# EAGLE design XY-Z (EAGLE 9.4.0)
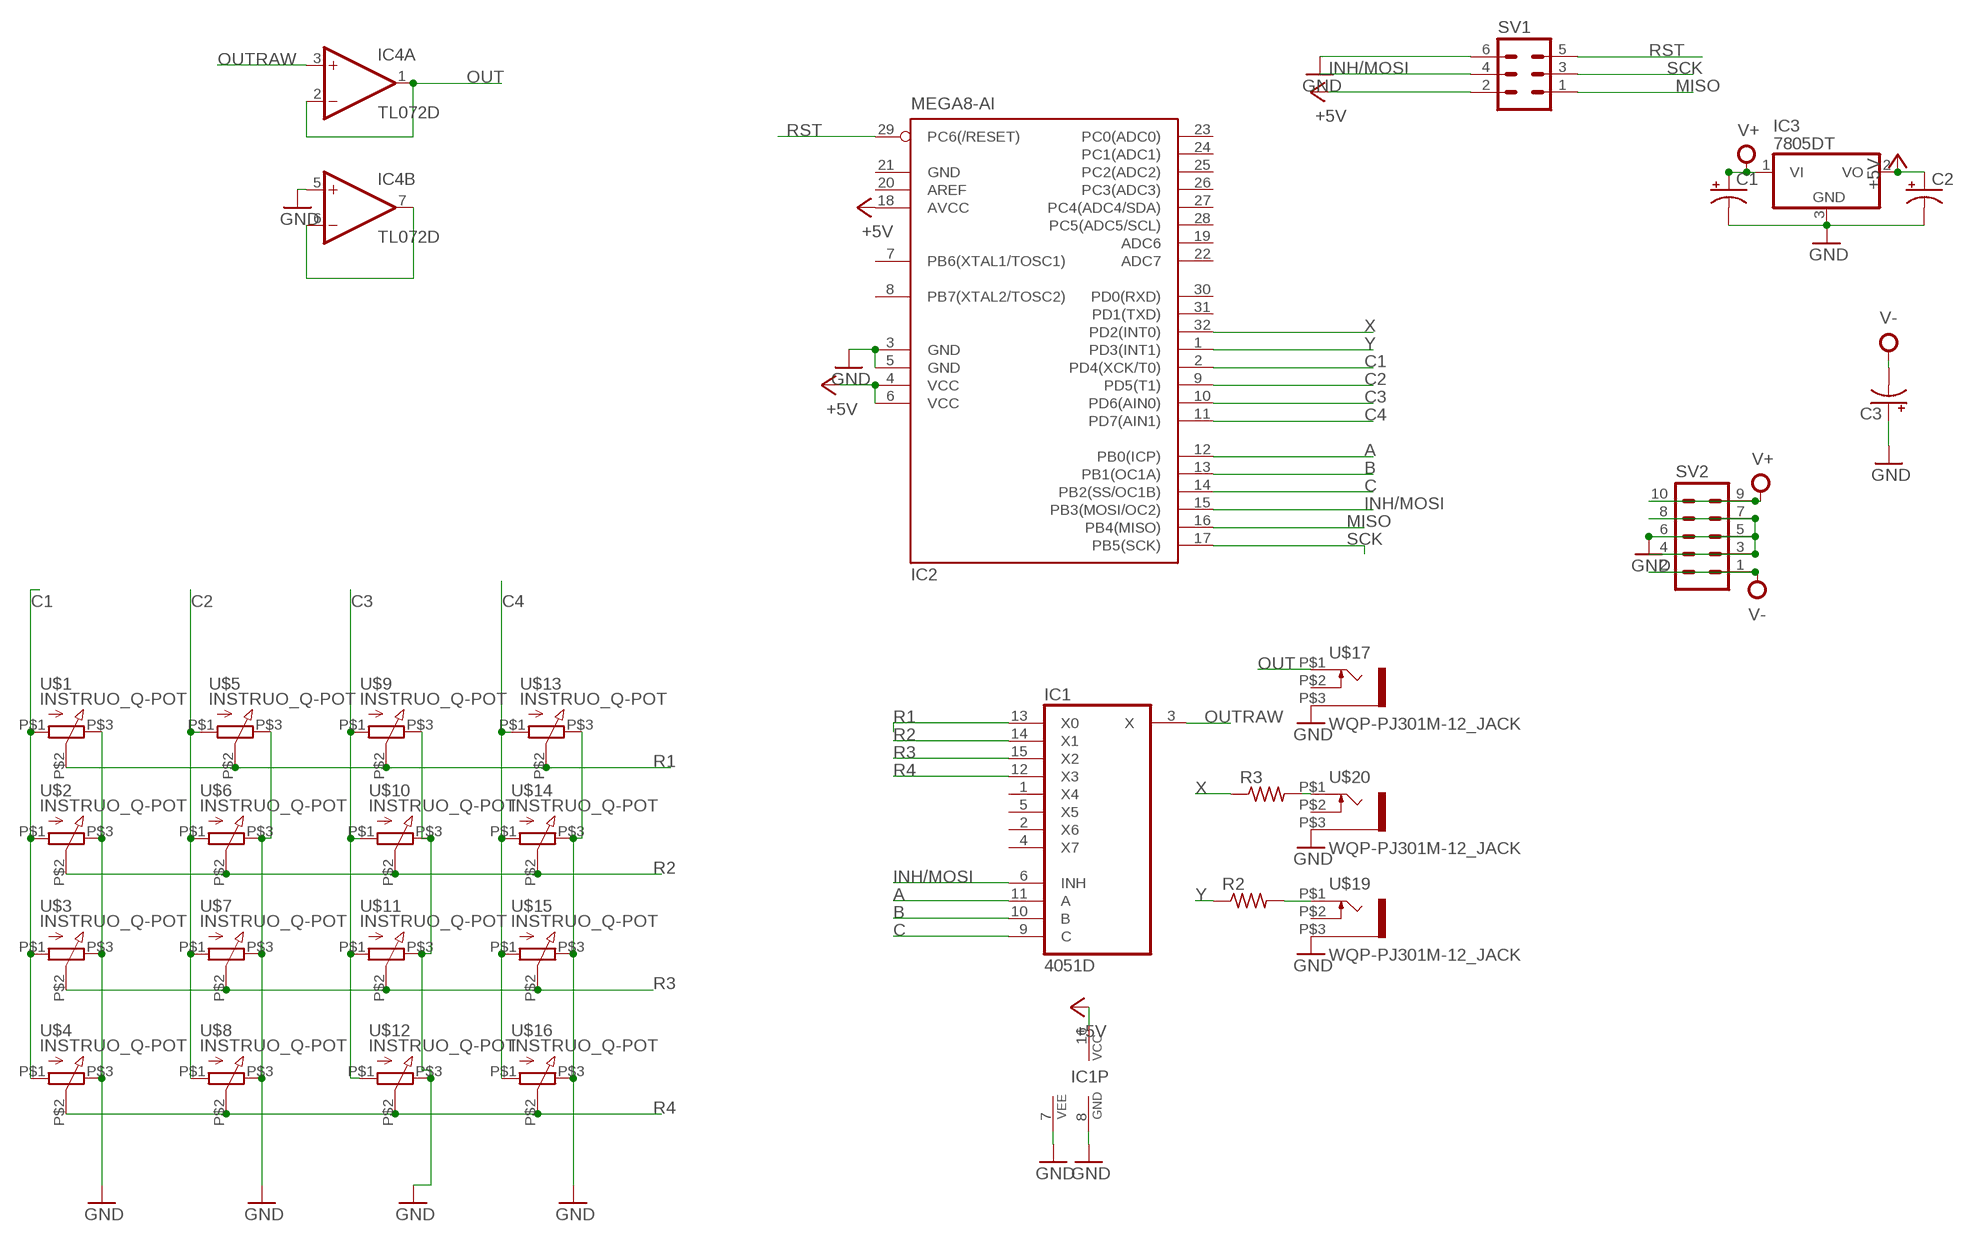
[diagram p0: schematic, sheet 1]

## Parts
C1  CPOL-US153CLV-0505  [153CLV-0505]
C2  CPOL-US153CLV-0505  [153CLV-0505]
C3  CPOL-US153CLV-0505  [153CLV-0505]
IC1  4051D  [SO16]
IC2  MEGA8-AI  [TQFP32-08]
IC3  7805DT  [TO252]
IC4  TL072D  [SO08]
R2  R-US_M0805  [M0805]
R3  R-US_M0805  [M0805]
SV1  MA03-2  [MA03-2]
SV2  MA05-2  [MA05-2]
U$1  INSTRUO_Q-POT  [INSTRUO_Q-POT]
U$2  INSTRUO_Q-POT  [INSTRUO_Q-POT]
U$3  INSTRUO_Q-POT  [INSTRUO_Q-POT]
U$4  INSTRUO_Q-POT  [INSTRUO_Q-POT]
U$5  INSTRUO_Q-POT  [INSTRUO_Q-POT]
U$6  INSTRUO_Q-POT  [INSTRUO_Q-POT]
U$7  INSTRUO_Q-POT  [INSTRUO_Q-POT]
U$8  INSTRUO_Q-POT  [INSTRUO_Q-POT]
U$9  INSTRUO_Q-POT  [INSTRUO_Q-POT]
U$10  INSTRUO_Q-POT  [INSTRUO_Q-POT]
U$11  INSTRUO_Q-POT  [INSTRUO_Q-POT]
U$12  INSTRUO_Q-POT  [INSTRUO_Q-POT]
U$13  INSTRUO_Q-POT  [INSTRUO_Q-POT]
U$14  INSTRUO_Q-POT  [INSTRUO_Q-POT]
U$15  INSTRUO_Q-POT  [INSTRUO_Q-POT]
U$16  INSTRUO_Q-POT  [INSTRUO_Q-POT]
U$17  WQP-PJ301M-12_JACK  [WQP-PJ301M-12_JACK]
U$19  WQP-PJ301M-12_JACK  [WQP-PJ301M-12_JACK]
U$20  WQP-PJ301M-12_JACK  [WQP-PJ301M-12_JACK]

## Nets
+5V: C2.+ IC1.16(VCC) IC2.4(VCC) IC2.6(VCC) IC2.18(AVCC) IC3.2(VO) SV1.2
A: IC1.11(A) IC2.12(PB0(ICP))
B: IC1.10(B) IC2.13(PB1(OC1A))
C: IC1.9(C) IC2.14(PB2(SS/OC1B))
C1: IC2.2(PD4(XCK/T0)) U$1.P$1 U$2.P$1 U$3.P$1 U$4.P$1
C2: IC2.9(PD5(T1)) U$5.P$1 U$6.P$1 U$7.P$1 U$8.P$1
C3: IC2.10(PD6(AIN0)) U$9.P$1 U$10.P$1 U$11.P$1 U$12.P$1
C4: IC2.11(PD7(AIN1)) U$13.P$1 U$14.P$1 U$15.P$1 U$16.P$1
GND: C1.- C2.- C3.+ IC1.7(VEE) IC1.8(GND) IC2.3(GND) IC2.5(GND) IC3.3(GND) IC4.5(B:+IN) SV1.6 SV2.3 SV2.4 SV2.5 SV2.6 SV2.7 SV2.8 U$1.P$3 U$2.P$3 U$3.P$3 U$4.P$3 U$5.P$3 U$6.P$3 U$7.P$3 U$8.P$3 U$9.P$3 U$10.P$3 U$11.P$3 U$12.P$3 U$13.P$3 U$14.P$3 U$15.P$3 U$16.P$3 U$17.P$3 U$19.P$3 U$20.P$3
INH/MOSI: IC1.6(INH) IC2.15(PB3(MOSI/OC2)) SV1.4
MISO: IC2.16(PB4(MISO)) SV1.1
N$1: R2.2 U$19.P$1
N$2: R3.2 U$20.P$1
N$3: IC4.6(B:-IN) IC4.7(B:OUT)
OUT: IC4.1(A:OUT) IC4.2(A:-IN) U$17.P$1
OUTRAW: IC1.3(X) IC4.3(A:+IN)
R1: IC1.13(X0) U$1.P$2 U$5.P$2 U$9.P$2 U$13.P$2
R2: IC1.14(X1) U$2.P$2 U$6.P$2 U$10.P$2 U$14.P$2
R3: IC1.15(X2) U$3.P$2 U$7.P$2 U$11.P$2 U$15.P$2
R4: IC1.12(X3) U$4.P$2 U$8.P$2 U$12.P$2 U$16.P$2
RST: IC2.29(PC6(/RESET)) SV1.5
SCK: IC2.17(PB5(SCK)) SV1.3
V+: C1.+ IC3.1(VI) SV2.9 SV2.10
V-: C3.- SV2.1 SV2.2
X: IC2.32(PD2(INT0)) R3.1
Y: IC2.1(PD3(INT1)) R2.1
Unconnected: IC1.1(X4) IC1.2(X6) IC1.4(X7) IC1.5(X5) IC2.7(PB6(XTAL1/TOSC1)) IC2.8(PB7(XTAL2/TOSC2)) IC2.19(ADC6) IC2.20(AREF) IC2.22(ADC7) IC2.23(PC0(ADC0)) IC2.24(PC1(ADC1)) IC2.25(PC2(ADC2)) IC2.26(PC3(ADC3)) IC2.27(PC4(ADC4/SDA)) IC2.28(PC5(ADC5/SCL)) IC2.30(PD0(RXD)) IC2.31(PD1(TXD)) U$17.P$2 U$19.P$2 U$20.P$2

## Power pins joined to a net without a drawn wire
GND: IC2.21(GND)
V+: IC4.8(P:V+)
V-: IC4.4(P:V-)

## Library data of the parts
C1-C3 = rcl:CPOL-US: POLARIZED CAPACITOR, American symbol; SPICEPREFIX: C
IC1 = 40xx:4051: 8-channel ANALOG MULTIPLEXER
IC2 = atmel:MEGA8: MICROCONTROLLER 8 Kbytes FLASH, 1 kbytes SRAM, 512 bytes EEPROM, USART, 6-channel 10 bit ADC, 2-channel 8 bit ADC Pin compatible with Atmega48, ATMega88, ATMega168 Source: avr.lbr; MPN: ATMEGA8-16AU; OC_FARNELL: 9171371; OC_NEWARK: 73M8863
IC3 = linear:78*: Positive VOLTAGE REGULATOR Source: http://cache.national.com/ds/LM/LM78L05.pdf http://www.fairchildsemi.com/ds/LM/LM7805.pdf
IC4 = linear3:TL072: OP AMP
R2 R3 = adafruit:R-US_: RESISTOR, American symbol
SV1 = con-lstb:MA03-2: PIN HEADER; OC_FARNELL: unknown; OC_NEWARK: unknown
SV2 = con-lstb:MA05-2: PIN HEADER; OC_FARNELL: unknown; OC_NEWARK: unknown
U$1-U$16 = Pure_VCO_SMD_V2_2:INSTRUO_Q-POT
U$17 U$19 U$20 = thonkiconn:WQP-PJ301M-12_JACK

## Board
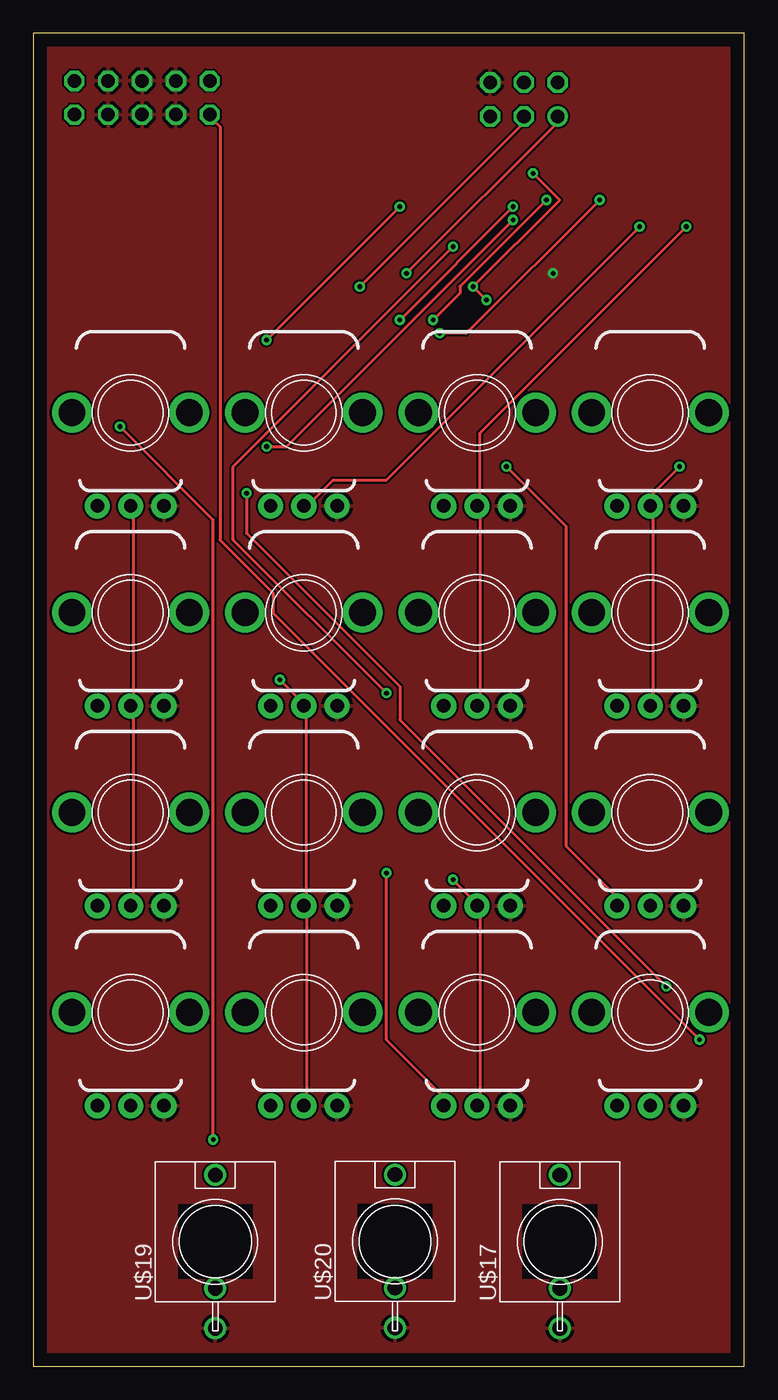
[diagram p1: board, top side]
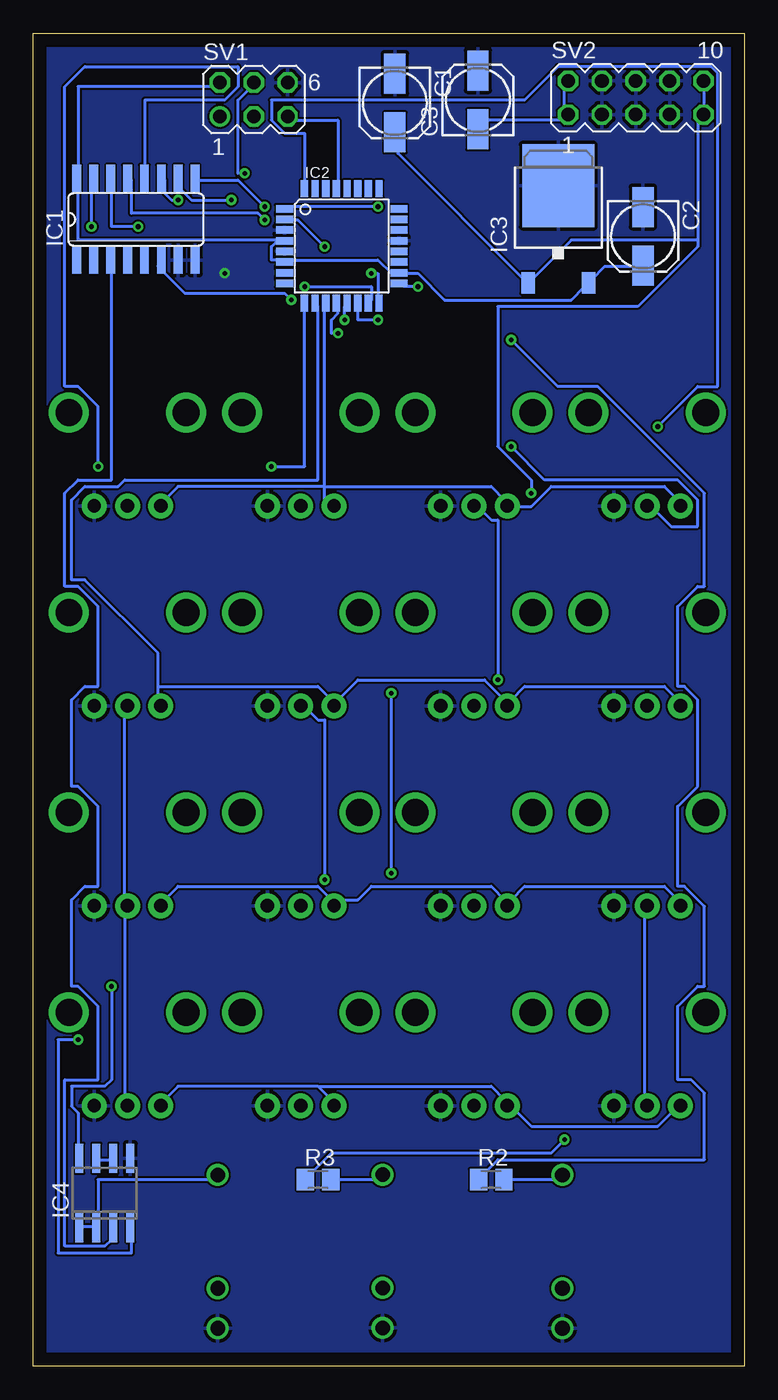
[diagram p2: board, bottom side, seen from below]

Size 53.37 x 100 mm. Coordinates in mm from the lower left corner, seen from the top.
Outline: 0,0 53.37,0 53.37,100 0,100 0,0
Copper layers (1*16): Top 0.035mm / dielectric 1.5mm / Bottom 0.035mm
Design rules "default *": minimum track width 9mil, minimum drill 0.35mm, track to track 6mil, track to pad 6mil, pad to pad 6mil, via to via 6mil, smd to smd 6mil, copper to edge 40mil, drill to drill 6mil, minimum pad ring 10mil, minimum via ring 8mil, stop-mask expansion 4mil, vias tented up to drill 0mil, thermal gap 10mil

### Footprints (pad centres in the part's own frame; a part is rotated, then mirrored left to right if it is on the bottom)
153CLV-0505 = smd 3 x 1.6: + 2.2,0; - -2.2,0
SO16 = smd 0.66 x 2.032: 1 -4.445,-3.073; 2 -3.175,-3.073; 3 -1.905,-3.073; 4 -0.635,-3.073; 5 0.635,-3.073; 6 1.905,-3.073; 7 3.175,-3.073; 8 4.445,-3.073; 9 4.445,3.073; 10 3.175,3.073; 11 1.905,3.073; 12 0.635,3.073; 13 -0.635,3.073; 14 -1.905,3.073; 15 -3.175,3.073; 16 -4.445,3.073
TQFP32-08 = smd 1.27 x 0.559: 1 -4.293,2.8; 2 -4.293,2; 3 -4.293,1.2; 4 -4.293,0.4; 5 -4.293,-0.4; 6 -4.293,-1.2; 7 -4.293,-2; 8 -4.293,-2.8; 17 4.293,-2.8; 18 4.293,-2; 19 4.293,-1.2; 20 4.293,-0.4; 21 4.293,0.4; 22 4.293,1.2; 23 4.293,2; 24 4.293,2.8 | smd 0.559 x 1.27: 9 -2.8,-4.293; 10 -2,-4.293; 11 -1.2,-4.293; 12 -0.4,-4.293; 13 0.4,-4.293; 14 1.2,-4.293; 15 2,-4.293; 16 2.8,-4.293; 25 2.8,4.293; 26 2,4.293; 27 1.2,4.293; 28 0.4,4.293; 29 -0.4,4.293; 30 -1.2,4.293; 31 -2,4.293; 32 -2.8,4.293
TO252 = smd 1 x 1.6: 1 -2.28,-4.8; 2 2.28,-4.8 | smd 5.4 x 6.2: 3 0,2.5
SO08 = smd 0.6 x 2.2: 1 -1.905,-2.6; 2 -0.635,-2.6; 3 0.635,-2.6; 4 1.905,-2.6; 5 1.905,2.6; 6 0.635,2.6; 7 -0.635,2.6; 8 -1.905,2.6
M0805 = smd 1.3 x 1.6: 1 -0.95,0; 2 0.95,0
MA03-2 = drill 1.016: 1 -2.54,-1.27 | drill 1.016 octagon: 2 -2.54,1.27; 3 0,-1.27; 4 0,1.27; 5 2.54,-1.27; 6 2.54,1.27
MA05-2 = drill 1.016 octagon: 1 -5.08,-1.27; 2 -5.08,1.27; 3 -2.54,-1.27; 4 -2.54,1.27; 5 0,-1.27; 6 0,1.27; 7 2.54,-1.27; 8 2.54,1.27; 9 5.08,-1.27; 10 5.08,1.27
INSTRUO_Q-POT = drill 1 pad 1.88: P$1 -2.5,-7; P$2 0,-7; P$3 2.5,-7 | drill 2 pad 2.68: P$4 -4.4,0; P$5 4.4,0
WQP-PJ301M-12_JACK = drill 1.1: P$1 0,5; P$2 0,-3.5; P$3 0,-6.5

### Placement (x,y rotation side)
C1  26.23,94.77 270 bottom
C2  7.61,84.77 270 bottom
C3  20,95 90 bottom
IC1  45.66,86.04 0 bottom
IC2  30.22,84.04 0 bottom
IC3  13.96,86.07 0 bottom
IC4  48,13 0 bottom
R2  19,14 0 bottom
R3  32,14 0 bottom
SV1  36.82,95.04 0 bottom
SV2  8.15,95.17 0 bottom
U$1  7.3,26.54 0 top
U$2  20.3,26.54 0 top
U$3  33.3,26.54 0 top
U$4  46.3,26.54 0 top
U$5  7.3,41.54 0 top
U$6  20.3,41.54 0 top
U$7  33.3,41.54 0 top
U$8  46.3,41.54 0 top
U$9  7.3,56.54 0 top
U$10  20.3,56.54 0 top
U$11  33.3,56.54 0 top
U$12  46.3,56.54 0 top
U$13  7.3,71.54 0 top
U$14  20.3,71.54 0 top
U$15  33.3,71.54 0 top
U$16  46.3,71.54 0 top
U$17  39.52,9.34 0 top
U$19  13.66,9.34 0 top
U$20  27.14,9.37 0 top

### Tracks (layer width: path | path; a pad name or v marks a point on that pad's centre or on a via)
+5V
  Bottom 0.229: SV1.2 39.5,96 50,96 50,89.5 IC1.16 50,89 50,84.5 35,84.5 | C2.+ 8,82.5 10.5,82.5 11.5,81.5 IC3.2 12,81 13,80 22.5,80 24.5,82 25.5,82 IC2.18 26,82 26.5,82 27.5,83 34.5,83 IC2.6 35,83 35.5,83 35.5,84 35,84.5 | 35,84.5 IC2.4
A  (via drill 0.35)
  Top 0.229: v30.5,77.5 32.5,77.5 v42.5,87.5
  Bottom 0.229: v30.5,77.5 31,77.5 31,78.5 30.5,79 30.5,79.5 IC2.12 | v42.5,87.5 43,87.5 43.5,88 43.5,89 IC1.11
B  (via drill 0.35)
  Top 0.229: v30,78.5 32,80.5 32,81 v38.5,87.5
  Bottom 0.229: v30,78.5 30,79.5 IC2.13 | v38.5,87.5 41.5,87.5 42.5,88.5 42.5,89 IC1.10
C  (via drill 0.35)
  Top 0.229: v36,87 v27.5,78.5
  Bottom 0.229: v27.5,78.5 29,78.5 29,79.5 IC2.14 | v36,87 38,89 41,89 IC1.9
C1  (via drill 0.35)
  Top 0.229: v31.5,84 15,67.5 15,62 v26.5,50.5 | v26.5,37 26.5,24.5 31,20 U$3.P$1
  Bottom 0.229: U$1.P$1 5,19.5 6.5,18 16,18 17.5,19.5 U$2.P$1 18,20 19,21 32,21 | v31.5,84 33.5,86 34.5,86 IC2.2 | v26.5,37 v26.5,50.5 | 32,21 42.5,21 43.5,20 U$4.P$1 | 32,21 31,20 U$3.P$1
C2  (via drill 0.35)
  Top 0.229: v35.5,67.5 40,63 40,39 44,35 U$8.P$1
  Bottom 0.229: U$5.P$1 5,35 6,36 16.5,36 17.5,35 U$6.P$1 18,35 19,36 28,36 29,35 30.5,35 U$7.P$1 31,35 32,36 42.5,36 43.5,35 U$8.P$1 | v35.5,67.5 33,67.5 33,79.5 IC2.9
C3
  Bottom 0.229: U$9.P$1 5,50 6,51 16.5,51 17.5,50 U$10.P$1 18,50 19.5,51.5 29,51.5 30.5,50 U$11.P$1 31,50 32,51 44,51 | 44,51 44,50 U$12.P$1 | 44,51 44,53.5 49.5,59 50.5,59 50.5,65 49.5,66 47,66 46.5,66.5 32,66.5 32,79.5 IC2.10
C4
  Bottom 0.229: U$13.P$1 5,65 6,66 14.5,66 16,64.5 17.5,64.5 U$14.P$1 18,65 19,66 31.5,66 | 31.5,66 31.5,65 31,65 U$15.P$1 | 31.5,66 31.5,79.5 IC2.11 | 31.5,66 42.5,66 43.5,65 U$16.P$1
GND  (via drill 0.35)
  other vias: 39,82
  pour Top: 0,100 53.29,100 53.34,99.95 53.34,0 0,0
  pour Bottom: 0,100 0,0 53.34,0 53.34,99.95 0.05,99.95
INH/MOSI  (via drill 0.35)
  Top 0.229: v34,80 v33,81 39.5,87.5 v37.5,89.5
  Bottom 0.229: v33,81 28,81 28,80 IC2.15 | v34,80 34.5,80.5 42,80.5 44,82.5 IC1.6 | v37.5,89.5 38,89.5 38,95 37,96 SV1.4
MISO  (via drill 0.35)
  Top 0.229: v28,82 39.5,93.5 SV1.1
  Bottom 0.229: v28,82 27.5,82 27.5,80 IC2.16
N$1
  Bottom 0.229: R2.2 14,14 U$19.P$1
N$2
  Bottom 0.229: R3.2 27.5,14 U$20.P$1
N$3
  Bottom 0.229: IC4.6 47.5,15.5 48.5,15.5 IC4.7
OUT
  Bottom 0.229: 48.5,10.5 50,10.5 IC4.1 | 48.5,10.5 48.5,14 40,14 U$17.P$1 | 48.5,10.5 IC4.2
OUTRAW
  Bottom 0.229: IC1.3 47.5,82.5 47.5,66.5 50,66.5 51,65.5 51,58.5 50,58.5 48.5,57 48.5,51 49.5,51 50.5,50 50.5,43.5 50,43.5 48.5,42 48.5,36 49.5,36 50.5,35 50.5,28.5 50,28.5 48.5,27 48.5,21.5 51,21.5 51,9 48,9 47.5,9.5 47.5,10 IC4.3
R1  (via drill 0.35)
  Top 0.229: v36,86 19,69 v17.5,69 | U$13.P$2 7.5,64.5 7.5,50 U$9.P$2 7.5,49.5 7.5,35 U$5.P$2
  Bottom 0.229: U$1.P$2 7.5,20 7.5,34.5 U$5.P$2 | v36,86 36.5,86.5 46,86.5 46,89 IC1.13 | v17.5,69 15,66.5 5,66.5 3.5,65 3.5,63 5.5,63 7,64.5 U$13.P$2
R2  (via drill 0.35)
  Top 0.229: U$2.P$2 20.5,20 20.5,34.5 U$6.P$2 20.5,35 20.5,49.5 U$10.P$2 20,50 v18.5,51.5 | v45.5,85.5 26.5,66.5 22.5,66.5 20.5,64.5 U$14.P$2
  Bottom 0.229: v45.5,85.5 47.5,85.5 47.5,89 IC1.14 | v18.5,51.5 18.5,63.5 19,63.5 20,64.5 U$14.P$2
R3  (via drill 0.35)
  Top 0.229: U$3.P$2 33.5,20 33.5,34.5 U$7.P$2 33,35 v31.5,36.5 | v49,85.5 33.5,70 33.5,65 U$15.P$2 33.5,64.5 33.5,50 U$11.P$2
  Bottom 0.229: v49,85.5 49,89 IC1.15 | v31.5,36.5 31.5,48.5 32,48.5 33,49.5 U$11.P$2
R4  (via drill 0.35)
  Top 0.229: v48.5,67.5 46,65 U$16.P$2 46.5,64.5 46.5,50 U$12.P$2
  Bottom 0.229: U$4.P$2 46.5,20 46.5,34.5 U$8.P$2 46.5,35 46.5,49.5 U$12.P$2 | v48.5,67.5 48.5,72 50,73.5 51,73.5 51,96 49.5,97.5 38,97.5 38,96 39,95 45,95 45,89.5 IC1.12
RST
  Bottom 0.229: IC2.29 30.5,88.5 30.5,93.5 34,93.5 SV1.5
SCK  (via drill 0.35)
  Top 0.229: v24.5,81 37,93.5 SV1.3
  Bottom 0.229: v24.5,81 25.5,81 IC2.17
V+  (via drill 0.35)
  Top 0.229: v47.5,28.5 27.5,48.5 27.5,51 16,62.5 v16,65.5
  Bottom 0.229: C1.+ 26,92.5 26,91 16.5,81.5 IC3.1 16,81.5 13,84.5 3.5,84.5 | v47.5,28.5 47.5,21.5 48,21 50.5,21 50.5,19.5 50,19 50,16 IC4.8 | v16,65.5 16,66.5 18.5,69 18.5,79.5 8,79.5 3.5,84 3.5,84.5 | 3.5,84.5 3.5,93.5 SV2.9 3,94 3,96 SV2.10
V-  (via drill 0.35)
  Top 0.229: v50,24.5 18,56.5 18,58 14,62 14,93 13.5,93.5 SV2.1
  Bottom 0.229: v50,24.5 51.5,24.5 51.5,8.5 46,8.5 46,10 IC4.4 | C3.- 20,93 19.5,93.5 13.5,93.5 SV2.1 13.5,94 13.5,96 SV2.2
X  (via drill 0.35)
  Top 0.229: v6.5,70.5 13.5,63.5 v13.5,17
  Bottom 0.229: v6.5,70.5 3.5,73.5 2,73.5 2,97 2.5,97.5 14,97.5 16.5,95 35.5,95 35.5,93.5 34.5,92.5 33,92.5 33,88.5 IC2.32 | v13.5,17 14.5,16 31,16 33,14 R3.1
Y  (via drill 0.35)
  Top 0.229: v17.5,77 v27.5,87
  Bottom 0.229: v27.5,87 34.5,87 IC2.1 | v17.5,77 14,73.5 11,73.5 3,65.5 3,58.5 3.5,58.5 5,57 5,51 4.5,51 3.5,50 3.5,43.5 5,42 5,36 4.5,36 3,34.5 3,28.5 3.5,28.5 5,27 5,21.5 4,21.5 3,20.5 3,15.5 18.5,15.5 20,14 R2.1